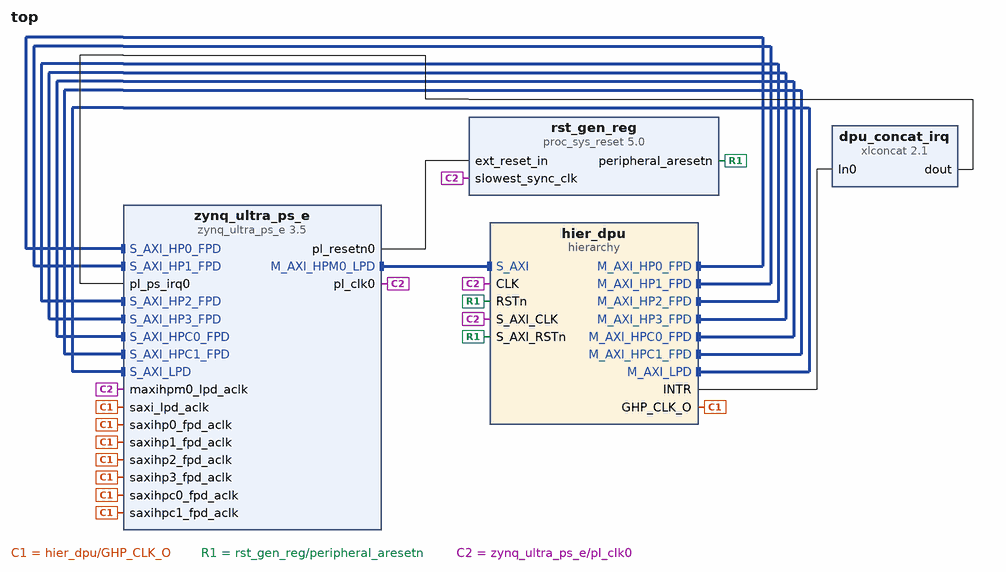
[diagram p0: block diagram of the top level]
# Vivado block design top, xczu9eg-ffvb1156-2-i, Vivado 2024.2
create_bd_design top

create_bd_cell -type hier hier_dpu
create_bd_cell -type ip -vlnv xilinx.com:ip:zynq_ultra_ps_e:3.5 zynq_ultra_ps_e
set_property -dict [list \
  CONFIG.PSU_BANK_0_IO_STANDARD LVCMOS18 \
  CONFIG.PSU_BANK_1_IO_STANDARD LVCMOS18 \
  CONFIG.PSU_BANK_2_IO_STANDARD LVCMOS18 \
  CONFIG.PSU_BANK_3_IO_STANDARD LVCMOS18 \
  CONFIG.PSU_DYNAMIC_DDR_CONFIG_EN 1 \
  CONFIG.PSU_USB3__DUAL_CLOCK_ENABLE 1 \
  CONFIG.PSU__CAN1__PERIPHERAL__ENABLE 1 \
  CONFIG.PSU__CAN1__PERIPHERAL__IO {MIO 24 .. 25} \
  CONFIG.PSU__CRF_APB__ACPU_CTRL__FREQMHZ 1334 \
  CONFIG.PSU__CRF_APB__DDR_CTRL__FREQMHZ 1067 \
  CONFIG.PSU__CRF_APB__DPDMA_REF_CTRL__FREQMHZ 667 \
  CONFIG.PSU__CRF_APB__DPDMA_REF_CTRL__SRCSEL APLL \
  CONFIG.PSU__CRF_APB__DP_AUDIO_REF_CTRL__SRCSEL RPLL \
  CONFIG.PSU__CRF_APB__DP_STC_REF_CTRL__SRCSEL RPLL \
  CONFIG.PSU__CRF_APB__DP_VIDEO_REF_CTRL__SRCSEL VPLL \
  CONFIG.PSU__CRF_APB__GDMA_REF_CTRL__FREQMHZ 667 \
  CONFIG.PSU__CRF_APB__GDMA_REF_CTRL__SRCSEL APLL \
  CONFIG.PSU__CRF_APB__GPU_REF_CTRL__FREQMHZ 500 \
  CONFIG.PSU__CRF_APB__GPU_REF_CTRL__SRCSEL IOPLL \
  CONFIG.PSU__CRF_APB__TOPSW_MAIN_CTRL__SRCSEL DPLL \
  CONFIG.PSU__CRL_APB__ADMA_REF_CTRL__FREQMHZ 500 \
  CONFIG.PSU__CRL_APB__ADMA_REF_CTRL__SRCSEL IOPLL \
  CONFIG.PSU__CRL_APB__CPU_R5_CTRL__FREQMHZ 500 \
  CONFIG.PSU__CRL_APB__CPU_R5_CTRL__SRCSEL IOPLL \
  CONFIG.PSU__CRL_APB__IOU_SWITCH_CTRL__FREQMHZ 250 \
  CONFIG.PSU__CRL_APB__IOU_SWITCH_CTRL__SRCSEL IOPLL \
  CONFIG.PSU__CRL_APB__LPD_SWITCH_CTRL__FREQMHZ 500 \
  CONFIG.PSU__CRL_APB__LPD_SWITCH_CTRL__SRCSEL IOPLL \
  CONFIG.PSU__CRL_APB__PL0_REF_CTRL__FREQMHZ 100 \
  CONFIG.PSU__CRL_APB__PL0_REF_CTRL__SRCSEL IOPLL \
  CONFIG.PSU__CRL_APB__PL1_REF_CTRL__FREQMHZ 334 \
  CONFIG.PSU__CRL_APB__QSPI_REF_CTRL__FREQMHZ 125 \
  CONFIG.PSU__CRL_APB__SDIO1_REF_CTRL__SRCSEL IOPLL \
  CONFIG.PSU__CRL_APB__TIMESTAMP_REF_CTRL__SRCSEL IOPLL \
  CONFIG.PSU__CRL_APB__USB3__ENABLE 1 \
  CONFIG.PSU__CSUPMU__PERIPHERAL__VALID 1 \
  CONFIG.PSU__DDRC__BUS_WIDTH {64 Bit} \
  CONFIG.PSU__DDRC__COMPONENTS UDIMM \
  CONFIG.PSU__DDRC__DEVICE_CAPACITY {4096 MBits} \
  CONFIG.PSU__DDRC__DRAM_WIDTH {8 Bits} \
  CONFIG.PSU__DDRC__ECC Disabled \
  CONFIG.PSU__DDRC__MEMORY_TYPE {DDR 4} \
  CONFIG.PSU__DDRC__SPEED_BIN DDR4_2133P \
  CONFIG.PSU__DDR_HIGH_ADDRESS_GUI_ENABLE 1 \
  CONFIG.PSU__DDR__INTERFACE__FREQMHZ 533.500 \
  CONFIG.PSU__DISPLAYPORT__LANE0__ENABLE 1 \
  CONFIG.PSU__DISPLAYPORT__LANE0__IO {GT Lane1} \
  CONFIG.PSU__DISPLAYPORT__LANE1__ENABLE 1 \
  CONFIG.PSU__DISPLAYPORT__LANE1__IO {GT Lane0} \
  CONFIG.PSU__DISPLAYPORT__PERIPHERAL__ENABLE 1 \
  CONFIG.PSU__DLL__ISUSED 1 \
  CONFIG.PSU__DPAUX__PERIPHERAL__ENABLE 1 \
  CONFIG.PSU__DPAUX__PERIPHERAL__IO {MIO 27 .. 30} \
  CONFIG.PSU__DP__LANE_SEL {Dual Lower} \
  CONFIG.PSU__DP__REF_CLK_FREQ 27 \
  CONFIG.PSU__DP__REF_CLK_SEL {Ref Clk3} \
  CONFIG.PSU__ENET3__FIFO__ENABLE 0 \
  CONFIG.PSU__ENET3__GRP_MDIO__ENABLE 1 \
  CONFIG.PSU__ENET3__GRP_MDIO__IO {MIO 76 .. 77} \
  CONFIG.PSU__ENET3__PERIPHERAL__ENABLE 1 \
  CONFIG.PSU__ENET3__PERIPHERAL__IO {MIO 64 .. 75} \
  CONFIG.PSU__ENET3__PTP__ENABLE 0 \
  CONFIG.PSU__ENET3__TSU__ENABLE 0 \
  CONFIG.PSU__FPGA_PL0_ENABLE 1 \
  CONFIG.PSU__FPGA_PL1_ENABLE 1 \
  CONFIG.PSU__GEM3_COHERENCY 0 \
  CONFIG.PSU__GEM3_ROUTE_THROUGH_FPD 0 \
  CONFIG.PSU__GEM__TSU__ENABLE 0 \
  CONFIG.PSU__GPIO0_MIO__IO {MIO 0 .. 25} \
  CONFIG.PSU__GPIO0_MIO__PERIPHERAL__ENABLE 1 \
  CONFIG.PSU__GPIO1_MIO__IO {MIO 26 .. 51} \
  CONFIG.PSU__GPIO1_MIO__PERIPHERAL__ENABLE 1 \
  CONFIG.PSU__GT__LINK_SPEED HBR \
  CONFIG.PSU__GT__PRE_EMPH_LVL_4 0 \
  CONFIG.PSU__GT__VLT_SWNG_LVL_4 0 \
  CONFIG.PSU__I2C0__PERIPHERAL__ENABLE 1 \
  CONFIG.PSU__I2C0__PERIPHERAL__IO {MIO 14 .. 15} \
  CONFIG.PSU__I2C1__PERIPHERAL__ENABLE 1 \
  CONFIG.PSU__I2C1__PERIPHERAL__IO {MIO 16 .. 17} \
  CONFIG.PSU__PCIE__CLASS_CODE_BASE 0x06 \
  CONFIG.PSU__PCIE__CLASS_CODE_SUB 0x04 \
  CONFIG.PSU__PCIE__DEVICE_ID 0xD021 \
  CONFIG.PSU__PMU_COHERENCY 0 \
  CONFIG.PSU__PMU__AIBACK__ENABLE 0 \
  CONFIG.PSU__PMU__EMIO_GPI__ENABLE 0 \
  CONFIG.PSU__PMU__EMIO_GPO__ENABLE 0 \
  CONFIG.PSU__PMU__GPI0__ENABLE 0 \
  CONFIG.PSU__PMU__GPI1__ENABLE 0 \
  CONFIG.PSU__PMU__GPI2__ENABLE 0 \
  CONFIG.PSU__PMU__GPI3__ENABLE 0 \
  CONFIG.PSU__PMU__GPI4__ENABLE 0 \
  CONFIG.PSU__PMU__GPI5__ENABLE 0 \
  CONFIG.PSU__PMU__GPO0__ENABLE 1 \
  CONFIG.PSU__PMU__GPO0__IO {MIO 32} \
  CONFIG.PSU__PMU__GPO1__ENABLE 1 \
  CONFIG.PSU__PMU__GPO1__IO {MIO 33} \
  CONFIG.PSU__PMU__GPO2__ENABLE 1 \
  CONFIG.PSU__PMU__GPO2__IO {MIO 34} \
  CONFIG.PSU__PMU__GPO2__POLARITY high \
  CONFIG.PSU__PMU__GPO3__ENABLE 1 \
  CONFIG.PSU__PMU__GPO3__IO {MIO 35} \
  CONFIG.PSU__PMU__GPO3__POLARITY low \
  CONFIG.PSU__PMU__GPO4__ENABLE 1 \
  CONFIG.PSU__PMU__GPO4__IO {MIO 36} \
  CONFIG.PSU__PMU__GPO4__POLARITY low \
  CONFIG.PSU__PMU__GPO5__ENABLE 1 \
  CONFIG.PSU__PMU__GPO5__IO {MIO 37} \
  CONFIG.PSU__PMU__GPO5__POLARITY low \
  CONFIG.PSU__PMU__PERIPHERAL__ENABLE 1 \
  CONFIG.PSU__PMU__PLERROR__ENABLE 0 \
  CONFIG.PSU__PSS_REF_CLK__FREQMHZ 33.330 \
  CONFIG.PSU__QSPI_COHERENCY 0 \
  CONFIG.PSU__QSPI_ROUTE_THROUGH_FPD 0 \
  CONFIG.PSU__QSPI__GRP_FBCLK__ENABLE 1 \
  CONFIG.PSU__QSPI__GRP_FBCLK__IO {MIO 6} \
  CONFIG.PSU__QSPI__PERIPHERAL__DATA_MODE x4 \
  CONFIG.PSU__QSPI__PERIPHERAL__ENABLE 1 \
  CONFIG.PSU__QSPI__PERIPHERAL__IO {MIO 0 .. 12} \
  CONFIG.PSU__QSPI__PERIPHERAL__MODE {Dual Parallel} \
  CONFIG.PSU__SATA__LANE1__IO {GT Lane3} \
  CONFIG.PSU__SATA__PERIPHERAL__ENABLE 1 \
  CONFIG.PSU__SATA__REF_CLK_FREQ 125 \
  CONFIG.PSU__SATA__REF_CLK_SEL {Ref Clk1} \
  CONFIG.PSU__SAXIGP6__DATA_WIDTH 32 \
  CONFIG.PSU__SD1_COHERENCY 0 \
  CONFIG.PSU__SD1_ROUTE_THROUGH_FPD 0 \
  CONFIG.PSU__SD1__CLK_100_SDR_OTAP_DLY 0x3 \
  CONFIG.PSU__SD1__CLK_200_SDR_OTAP_DLY 0x3 \
  CONFIG.PSU__SD1__CLK_50_DDR_ITAP_DLY 0x3D \
  CONFIG.PSU__SD1__CLK_50_DDR_OTAP_DLY 0x4 \
  CONFIG.PSU__SD1__CLK_50_SDR_ITAP_DLY 0x15 \
  CONFIG.PSU__SD1__CLK_50_SDR_OTAP_DLY 0x5 \
  CONFIG.PSU__SD1__DATA_TRANSFER_MODE 8Bit \
  CONFIG.PSU__SD1__GRP_CD__ENABLE 1 \
  CONFIG.PSU__SD1__GRP_CD__IO {MIO 45} \
  CONFIG.PSU__SD1__GRP_POW__ENABLE 0 \
  CONFIG.PSU__SD1__GRP_WP__ENABLE 1 \
  CONFIG.PSU__SD1__GRP_WP__IO {MIO 44} \
  CONFIG.PSU__SD1__PERIPHERAL__ENABLE 1 \
  CONFIG.PSU__SD1__PERIPHERAL__IO {MIO 39 .. 51} \
  CONFIG.PSU__SD1__SLOT_TYPE {SD 3.0} \
  CONFIG.PSU__SWDT0__CLOCK__ENABLE 0 \
  CONFIG.PSU__SWDT0__PERIPHERAL__ENABLE 1 \
  CONFIG.PSU__SWDT0__RESET__ENABLE 0 \
  CONFIG.PSU__SWDT1__CLOCK__ENABLE 0 \
  CONFIG.PSU__SWDT1__PERIPHERAL__ENABLE 1 \
  CONFIG.PSU__SWDT1__RESET__ENABLE 0 \
  CONFIG.PSU__TSU__BUFG_PORT_PAIR 0 \
  CONFIG.PSU__TTC0__CLOCK__ENABLE 0 \
  CONFIG.PSU__TTC0__PERIPHERAL__ENABLE 1 \
  CONFIG.PSU__TTC0__WAVEOUT__ENABLE 0 \
  CONFIG.PSU__TTC1__CLOCK__ENABLE 0 \
  CONFIG.PSU__TTC1__PERIPHERAL__ENABLE 1 \
  CONFIG.PSU__TTC1__WAVEOUT__ENABLE 0 \
  CONFIG.PSU__TTC2__CLOCK__ENABLE 0 \
  CONFIG.PSU__TTC2__PERIPHERAL__ENABLE 1 \
  CONFIG.PSU__TTC2__WAVEOUT__ENABLE 0 \
  CONFIG.PSU__TTC3__CLOCK__ENABLE 0 \
  CONFIG.PSU__TTC3__PERIPHERAL__ENABLE 1 \
  CONFIG.PSU__TTC3__WAVEOUT__ENABLE 0 \
  CONFIG.PSU__UART0__BAUD_RATE 115200 \
  CONFIG.PSU__UART0__MODEM__ENABLE 0 \
  CONFIG.PSU__UART0__PERIPHERAL__ENABLE 1 \
  CONFIG.PSU__UART0__PERIPHERAL__IO {MIO 18 .. 19} \
  CONFIG.PSU__UART1__BAUD_RATE 115200 \
  CONFIG.PSU__UART1__MODEM__ENABLE 0 \
  CONFIG.PSU__UART1__PERIPHERAL__ENABLE 1 \
  CONFIG.PSU__UART1__PERIPHERAL__IO {MIO 20 .. 21} \
  CONFIG.PSU__USB0_COHERENCY 0 \
  CONFIG.PSU__USB0__PERIPHERAL__ENABLE 1 \
  CONFIG.PSU__USB0__PERIPHERAL__IO {MIO 52 .. 63} \
  CONFIG.PSU__USB0__REF_CLK_FREQ 26 \
  CONFIG.PSU__USB0__REF_CLK_SEL {Ref Clk2} \
  CONFIG.PSU__USB2_0__EMIO__ENABLE 0 \
  CONFIG.PSU__USB3_0__EMIO__ENABLE 0 \
  CONFIG.PSU__USB3_0__PERIPHERAL__ENABLE 1 \
  CONFIG.PSU__USB3_0__PERIPHERAL__IO {GT Lane2} \
  CONFIG.PSU__USB__RESET__MODE {Boot Pin} \
  CONFIG.PSU__USB__RESET__POLARITY {Active Low} \
  CONFIG.PSU__USE__IRQ0 1 \
  CONFIG.PSU__USE__IRQ1 1 \
  CONFIG.PSU__USE__M_AXI_GP2 1 \
  CONFIG.PSU__USE__S_AXI_GP0 1 \
  CONFIG.PSU__USE__S_AXI_GP1 1 \
  CONFIG.PSU__USE__S_AXI_GP2 1 \
  CONFIG.PSU__USE__S_AXI_GP3 1 \
  CONFIG.PSU__USE__S_AXI_GP4 1 \
  CONFIG.PSU__USE__S_AXI_GP5 1 \
  CONFIG.PSU__USE__S_AXI_GP6 1 \
] [get_bd_cells zynq_ultra_ps_e]
# 116 more settings of zynq_ultra_ps_e are not shown: defaults, MIO pin electricals, DDR timing, and values the tool derives
create_bd_cell -type ip -vlnv xilinx.com:ip:xlconcat:2.1 dpu_concat_irq
set_property -dict {CONFIG.NUM_PORTS 1} [get_bd_cells dpu_concat_irq]
create_bd_cell -type ip -vlnv xilinx.com:ip:proc_sys_reset:5.0 rst_gen_reg

# ---- hierarchy /hier_dpu ----
current_bd_instance /hier_dpu
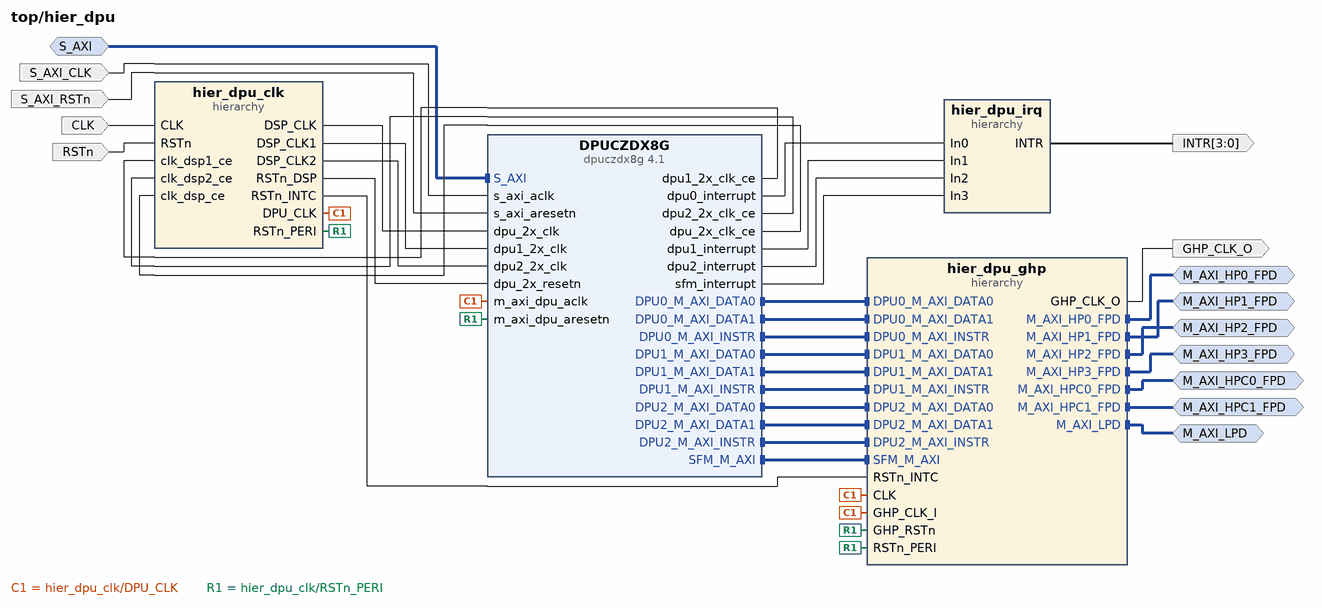
[diagram p1: block diagram inside /hier_dpu]
create_bd_intf_pin -mode Slave -vlnv xilinx.com:interface:aximm_rtl:1.0 S_AXI
create_bd_intf_pin -mode Master -vlnv xilinx.com:interface:aximm_rtl:1.0 M_AXI_HPC0_FPD
create_bd_intf_pin -mode Master -vlnv xilinx.com:interface:aximm_rtl:1.0 M_AXI_HPC1_FPD
create_bd_intf_pin -mode Master -vlnv xilinx.com:interface:aximm_rtl:1.0 M_AXI_HP0_FPD
create_bd_intf_pin -mode Master -vlnv xilinx.com:interface:aximm_rtl:1.0 M_AXI_HP1_FPD
create_bd_intf_pin -mode Master -vlnv xilinx.com:interface:aximm_rtl:1.0 M_AXI_HP2_FPD
create_bd_intf_pin -mode Master -vlnv xilinx.com:interface:aximm_rtl:1.0 M_AXI_HP3_FPD
create_bd_intf_pin -mode Master -vlnv xilinx.com:interface:aximm_rtl:1.0 M_AXI_LPD
create_bd_pin -dir I -type clk S_AXI_CLK
create_bd_pin -dir I -type rst S_AXI_RSTn
create_bd_pin -dir O -type clk GHP_CLK_O
create_bd_pin -dir O -from 3 -to 0 -type intr INTR
create_bd_pin -dir I -type clk CLK
create_bd_pin -dir I -type rst RSTn

create_bd_cell -type hier hier_dpu_clk
create_bd_cell -type hier hier_dpu_ghp
create_bd_cell -type hier hier_dpu_irq
create_bd_cell -type ip -vlnv xilinx.com:ip:dpuczdx8g:4.1 DPUCZDX8G
set_property -dict [list \
  CONFIG.ALU_LEAKYRELU 0 \
  CONFIG.ALU_PARALLEL_USER 4 \
  CONFIG.ARCH 4096 \
  CONFIG.ARCH_IMG_BKGRP 2 \
  CONFIG.CLK_GATING_ENA 1 \
  CONFIG.CONV_DSP_ACCU_ENA 1 \
  CONFIG.CONV_DSP_CASC_MAX 4 \
  CONFIG.CONV_RELU_ADDON 3 \
  CONFIG.CONV_WR_PARALLEL 1 \
  CONFIG.LOAD_AUGM 1 \
  CONFIG.SAVE_ARGMAX_ENA 1 \
  CONFIG.SFM_ENA 1 \
  CONFIG.S_AXI_CLK_INDEPENDENT 1 \
  CONFIG.TIMESTAMP_ENA 1 \
  CONFIG.TIME_DAY 16 \
  CONFIG.TIME_HOUR 8 \
  CONFIG.TIME_MONTH 5 \
  CONFIG.TIME_QUARTER 2 \
  CONFIG.TIME_YEAR 25 \
  CONFIG.URAM_N_USER 0 \
  CONFIG.VER_DPU_NUM 3 \
] [get_bd_cells DPUCZDX8G]

# ---- hierarchy /hier_dpu/hier_dpu_clk ----
current_bd_instance /hier_dpu/hier_dpu_clk
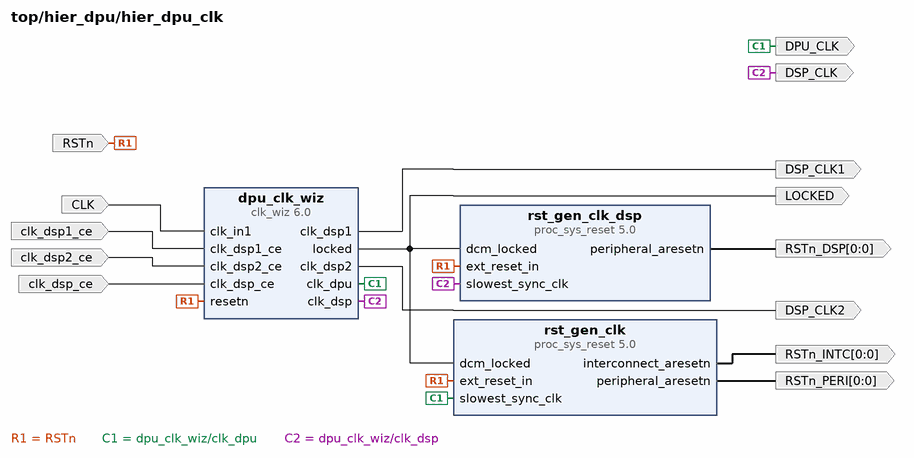
[diagram p2: block diagram inside /hier_dpu/hier_dpu_clk]
create_bd_pin -dir I -type clk CLK
create_bd_pin -dir I -type rst RSTn
create_bd_pin -dir O -type clk DSP_CLK
create_bd_pin -dir O -type clk DSP_CLK1
create_bd_pin -dir O -type clk DSP_CLK2
create_bd_pin -dir O -from 0 -to 0 -type rst RSTn_DSP
create_bd_pin -dir O -type clk DPU_CLK
create_bd_pin -dir O -type data LOCKED
create_bd_pin -dir O -from 0 -to 0 -type rst RSTn_INTC
create_bd_pin -dir O -from 0 -to 0 -type rst RSTn_PERI
create_bd_pin -dir I -type ce clk_dsp_ce
create_bd_pin -dir I -type ce clk_dsp1_ce
create_bd_pin -dir I -type ce clk_dsp2_ce

create_bd_cell -type ip -vlnv xilinx.com:ip:clk_wiz:6.0 dpu_clk_wiz
set_property -dict [list \
  CONFIG.CLKOUT1_DRIVES Buffer_with_CE \
  CONFIG.CLKOUT1_MATCHED_ROUTING true \
  CONFIG.CLKOUT1_REQUESTED_OUT_FREQ 650 \
  CONFIG.CLKOUT2_DRIVES Buffer_with_CE \
  CONFIG.CLKOUT2_MATCHED_ROUTING true \
  CONFIG.CLKOUT2_REQUESTED_OUT_FREQ 650 \
  CONFIG.CLKOUT2_USED true \
  CONFIG.CLKOUT3_DRIVES Buffer_with_CE \
  CONFIG.CLKOUT3_MATCHED_ROUTING true \
  CONFIG.CLKOUT3_REQUESTED_OUT_FREQ 650 \
  CONFIG.CLKOUT3_USED true \
  CONFIG.CLKOUT4_MATCHED_ROUTING true \
  CONFIG.CLKOUT4_REQUESTED_OUT_FREQ 325 \
  CONFIG.CLKOUT4_USED true \
  CONFIG.CLK_OUT1_PORT clk_dsp \
  CONFIG.CLK_OUT2_PORT clk_dsp1 \
  CONFIG.CLK_OUT3_PORT clk_dsp2 \
  CONFIG.CLK_OUT4_PORT clk_dpu \
  CONFIG.PRIMITIVE Auto \
  CONFIG.RESET_TYPE ACTIVE_LOW \
  CONFIG.USE_LOCKED true \
  CONFIG.USE_RESET true \
] [get_bd_cells dpu_clk_wiz]
create_bd_cell -type ip -vlnv xilinx.com:ip:proc_sys_reset:5.0 rst_gen_clk
create_bd_cell -type ip -vlnv xilinx.com:ip:proc_sys_reset:5.0 rst_gen_clk_dsp

# ---- hierarchy /hier_dpu/hier_dpu_ghp ----
current_bd_instance /hier_dpu/hier_dpu_ghp
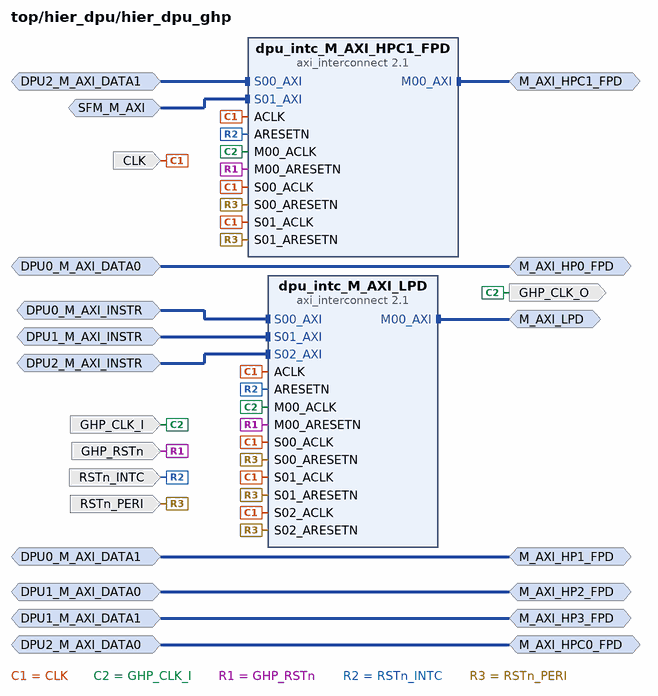
[diagram p3: block diagram inside /hier_dpu/hier_dpu_ghp]
create_bd_intf_pin -mode Slave -vlnv xilinx.com:interface:aximm_rtl:1.0 DPU0_M_AXI_DATA0
create_bd_intf_pin -mode Slave -vlnv xilinx.com:interface:aximm_rtl:1.0 DPU0_M_AXI_DATA1
create_bd_intf_pin -mode Slave -vlnv xilinx.com:interface:aximm_rtl:1.0 DPU0_M_AXI_INSTR
create_bd_intf_pin -mode Slave -vlnv xilinx.com:interface:aximm_rtl:1.0 DPU1_M_AXI_DATA0
create_bd_intf_pin -mode Slave -vlnv xilinx.com:interface:aximm_rtl:1.0 DPU1_M_AXI_DATA1
create_bd_intf_pin -mode Slave -vlnv xilinx.com:interface:aximm_rtl:1.0 DPU1_M_AXI_INSTR
create_bd_intf_pin -mode Slave -vlnv xilinx.com:interface:aximm_rtl:1.0 DPU2_M_AXI_DATA0
create_bd_intf_pin -mode Slave -vlnv xilinx.com:interface:aximm_rtl:1.0 DPU2_M_AXI_DATA1
create_bd_intf_pin -mode Slave -vlnv xilinx.com:interface:aximm_rtl:1.0 DPU2_M_AXI_INSTR
create_bd_intf_pin -mode Slave -vlnv xilinx.com:interface:aximm_rtl:1.0 SFM_M_AXI
create_bd_intf_pin -mode Master -vlnv xilinx.com:interface:aximm_rtl:1.0 M_AXI_HPC0_FPD
create_bd_intf_pin -mode Master -vlnv xilinx.com:interface:aximm_rtl:1.0 M_AXI_HPC1_FPD
create_bd_intf_pin -mode Master -vlnv xilinx.com:interface:aximm_rtl:1.0 M_AXI_HP0_FPD
create_bd_intf_pin -mode Master -vlnv xilinx.com:interface:aximm_rtl:1.0 M_AXI_HP1_FPD
create_bd_intf_pin -mode Master -vlnv xilinx.com:interface:aximm_rtl:1.0 M_AXI_HP2_FPD
create_bd_intf_pin -mode Master -vlnv xilinx.com:interface:aximm_rtl:1.0 M_AXI_HP3_FPD
create_bd_intf_pin -mode Master -vlnv xilinx.com:interface:aximm_rtl:1.0 M_AXI_LPD
create_bd_pin -dir I -type clk CLK
create_bd_pin -dir I -type rst RSTn_INTC
create_bd_pin -dir I -type rst RSTn_PERI
create_bd_pin -dir I -type clk GHP_CLK_I
create_bd_pin -dir I -type rst GHP_RSTn
create_bd_pin -dir O -type clk GHP_CLK_O

create_bd_cell -type ip -vlnv xilinx.com:ip:axi_interconnect:2.1 dpu_intc_M_AXI_LPD
set_property -dict {CONFIG.NUM_MI 1 CONFIG.NUM_SI 3} [get_bd_cells dpu_intc_M_AXI_LPD]
create_bd_cell -type ip -vlnv xilinx.com:ip:axi_interconnect:2.1 dpu_intc_M_AXI_HPC1_FPD
set_property -dict {CONFIG.NUM_MI 1 CONFIG.NUM_SI 2} [get_bd_cells dpu_intc_M_AXI_HPC1_FPD]

# ---- hierarchy /hier_dpu/hier_dpu_irq ----
current_bd_instance /hier_dpu/hier_dpu_irq
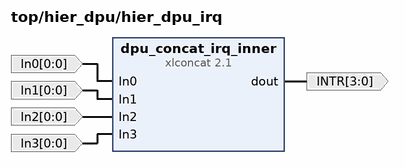
[diagram p4: block diagram inside /hier_dpu/hier_dpu_irq]
create_bd_pin -dir O -from 3 -to 0 -type intr INTR
create_bd_pin -dir I -from 0 -to 0 In0
create_bd_pin -dir I -from 0 -to 0 In1
create_bd_pin -dir I -from 0 -to 0 In2
create_bd_pin -dir I -from 0 -to 0 In3

create_bd_cell -type ip -vlnv xilinx.com:ip:xlconcat:2.1 dpu_concat_irq_inner
set_property -dict {CONFIG.NUM_PORTS 4} [get_bd_cells dpu_concat_irq_inner]

# ---- connections ----

current_bd_instance /hier_dpu
connect_bd_intf_net [get_bd_intf_pins hier_dpu_ghp/M_AXI_HPC0_FPD] [get_bd_intf_pins M_AXI_HPC0_FPD]
connect_bd_intf_net [get_bd_intf_pins hier_dpu_ghp/M_AXI_HPC1_FPD] [get_bd_intf_pins M_AXI_HPC1_FPD]
connect_bd_intf_net [get_bd_intf_pins hier_dpu_ghp/M_AXI_HP0_FPD] [get_bd_intf_pins M_AXI_HP0_FPD]
connect_bd_intf_net [get_bd_intf_pins hier_dpu_ghp/M_AXI_HP1_FPD] [get_bd_intf_pins M_AXI_HP1_FPD]
connect_bd_intf_net [get_bd_intf_pins hier_dpu_ghp/M_AXI_HP2_FPD] [get_bd_intf_pins M_AXI_HP2_FPD]
connect_bd_intf_net [get_bd_intf_pins hier_dpu_ghp/M_AXI_HP3_FPD] [get_bd_intf_pins M_AXI_HP3_FPD]
connect_bd_intf_net [get_bd_intf_pins hier_dpu_ghp/M_AXI_LPD] [get_bd_intf_pins M_AXI_LPD]
connect_bd_intf_net [get_bd_intf_pins DPUCZDX8G/DPU0_M_AXI_DATA0] [get_bd_intf_pins hier_dpu_ghp/DPU0_M_AXI_DATA0]
connect_bd_intf_net [get_bd_intf_pins DPUCZDX8G/DPU0_M_AXI_DATA1] [get_bd_intf_pins hier_dpu_ghp/DPU0_M_AXI_DATA1]
connect_bd_intf_net [get_bd_intf_pins DPUCZDX8G/DPU0_M_AXI_INSTR] [get_bd_intf_pins hier_dpu_ghp/DPU0_M_AXI_INSTR]
connect_bd_intf_net [get_bd_intf_pins DPUCZDX8G/DPU1_M_AXI_DATA0] [get_bd_intf_pins hier_dpu_ghp/DPU1_M_AXI_DATA0]
connect_bd_intf_net [get_bd_intf_pins DPUCZDX8G/DPU1_M_AXI_DATA1] [get_bd_intf_pins hier_dpu_ghp/DPU1_M_AXI_DATA1]
connect_bd_intf_net [get_bd_intf_pins DPUCZDX8G/DPU1_M_AXI_INSTR] [get_bd_intf_pins hier_dpu_ghp/DPU1_M_AXI_INSTR]
connect_bd_intf_net [get_bd_intf_pins DPUCZDX8G/DPU2_M_AXI_DATA0] [get_bd_intf_pins hier_dpu_ghp/DPU2_M_AXI_DATA0]
connect_bd_intf_net [get_bd_intf_pins DPUCZDX8G/DPU2_M_AXI_DATA1] [get_bd_intf_pins hier_dpu_ghp/DPU2_M_AXI_DATA1]
connect_bd_intf_net [get_bd_intf_pins DPUCZDX8G/DPU2_M_AXI_INSTR] [get_bd_intf_pins hier_dpu_ghp/DPU2_M_AXI_INSTR]
connect_bd_intf_net [get_bd_intf_pins DPUCZDX8G/SFM_M_AXI] [get_bd_intf_pins hier_dpu_ghp/SFM_M_AXI]
connect_bd_intf_net [get_bd_intf_pins S_AXI] [get_bd_intf_pins DPUCZDX8G/S_AXI]
connect_bd_net [get_bd_pins CLK] [get_bd_pins hier_dpu_clk/CLK]
connect_bd_net [get_bd_pins DPUCZDX8G/dpu0_interrupt] [get_bd_pins hier_dpu_irq/In0]
connect_bd_net [get_bd_pins DPUCZDX8G/dpu1_2x_clk_ce] [get_bd_pins hier_dpu_clk/clk_dsp1_ce]
connect_bd_net [get_bd_pins DPUCZDX8G/dpu1_interrupt] [get_bd_pins hier_dpu_irq/In1]
connect_bd_net [get_bd_pins DPUCZDX8G/dpu2_2x_clk_ce] [get_bd_pins hier_dpu_clk/clk_dsp2_ce]
connect_bd_net [get_bd_pins DPUCZDX8G/dpu2_interrupt] [get_bd_pins hier_dpu_irq/In2]
connect_bd_net [get_bd_pins DPUCZDX8G/dpu_2x_clk_ce] [get_bd_pins hier_dpu_clk/clk_dsp_ce]
connect_bd_net [get_bd_pins DPUCZDX8G/sfm_interrupt] [get_bd_pins hier_dpu_irq/In3]
connect_bd_net [get_bd_pins RSTn] [get_bd_pins hier_dpu_clk/RSTn]
connect_bd_net [get_bd_pins S_AXI_CLK] [get_bd_pins DPUCZDX8G/s_axi_aclk]
connect_bd_net [get_bd_pins S_AXI_RSTn] [get_bd_pins DPUCZDX8G/s_axi_aresetn]
connect_bd_net [get_bd_pins hier_dpu_clk/DPU_CLK] \
  [get_bd_pins DPUCZDX8G/m_axi_dpu_aclk] [get_bd_pins hier_dpu_ghp/CLK] [get_bd_pins hier_dpu_ghp/GHP_CLK_I]
connect_bd_net [get_bd_pins hier_dpu_clk/DSP_CLK] [get_bd_pins DPUCZDX8G/dpu_2x_clk]
connect_bd_net [get_bd_pins hier_dpu_clk/DSP_CLK1] [get_bd_pins DPUCZDX8G/dpu1_2x_clk]
connect_bd_net [get_bd_pins hier_dpu_clk/DSP_CLK2] [get_bd_pins DPUCZDX8G/dpu2_2x_clk]
connect_bd_net [get_bd_pins hier_dpu_clk/RSTn_DSP] [get_bd_pins DPUCZDX8G/dpu_2x_resetn]
connect_bd_net [get_bd_pins hier_dpu_clk/RSTn_INTC] [get_bd_pins hier_dpu_ghp/RSTn_INTC]
connect_bd_net [get_bd_pins hier_dpu_clk/RSTn_PERI] \
  [get_bd_pins DPUCZDX8G/m_axi_dpu_aresetn] [get_bd_pins hier_dpu_ghp/RSTn_PERI] [get_bd_pins hier_dpu_ghp/GHP_RSTn]
connect_bd_net [get_bd_pins hier_dpu_ghp/GHP_CLK_O] [get_bd_pins GHP_CLK_O]
connect_bd_net [get_bd_pins hier_dpu_irq/INTR] [get_bd_pins INTR]

current_bd_instance /hier_dpu/hier_dpu_clk
connect_bd_net [get_bd_pins CLK] [get_bd_pins dpu_clk_wiz/clk_in1]
connect_bd_net [get_bd_pins RSTn] [get_bd_pins dpu_clk_wiz/resetn] [get_bd_pins rst_gen_clk/ext_reset_in] [get_bd_pins rst_gen_clk_dsp/ext_reset_in]
connect_bd_net [get_bd_pins clk_dsp1_ce] [get_bd_pins dpu_clk_wiz/clk_dsp1_ce]
connect_bd_net [get_bd_pins clk_dsp2_ce] [get_bd_pins dpu_clk_wiz/clk_dsp2_ce]
connect_bd_net [get_bd_pins clk_dsp_ce] [get_bd_pins dpu_clk_wiz/clk_dsp_ce]
connect_bd_net [get_bd_pins dpu_clk_wiz/clk_dpu] [get_bd_pins DPU_CLK] [get_bd_pins rst_gen_clk/slowest_sync_clk]
connect_bd_net [get_bd_pins dpu_clk_wiz/clk_dsp] [get_bd_pins DSP_CLK] [get_bd_pins rst_gen_clk_dsp/slowest_sync_clk]
connect_bd_net [get_bd_pins dpu_clk_wiz/clk_dsp1] [get_bd_pins DSP_CLK1]
connect_bd_net [get_bd_pins dpu_clk_wiz/clk_dsp2] [get_bd_pins DSP_CLK2]
connect_bd_net [get_bd_pins dpu_clk_wiz/locked] [get_bd_pins LOCKED] [get_bd_pins rst_gen_clk/dcm_locked] [get_bd_pins rst_gen_clk_dsp/dcm_locked]
connect_bd_net [get_bd_pins rst_gen_clk_dsp/peripheral_aresetn] [get_bd_pins RSTn_DSP]
connect_bd_net [get_bd_pins rst_gen_clk/interconnect_aresetn] [get_bd_pins RSTn_INTC]
connect_bd_net [get_bd_pins rst_gen_clk/peripheral_aresetn] [get_bd_pins RSTn_PERI]

current_bd_instance /hier_dpu/hier_dpu_ghp
connect_bd_intf_net -intf_net DPU0_M_AXI_DATA0_1 [get_bd_intf_pins DPU0_M_AXI_DATA0] [get_bd_intf_pins M_AXI_HP0_FPD]
connect_bd_intf_net -intf_net DPU0_M_AXI_DATA1_1 [get_bd_intf_pins DPU0_M_AXI_DATA1] [get_bd_intf_pins M_AXI_HP1_FPD]
connect_bd_intf_net [get_bd_intf_pins DPU0_M_AXI_INSTR] [get_bd_intf_pins dpu_intc_M_AXI_LPD/S00_AXI]
connect_bd_intf_net -intf_net DPU1_M_AXI_DATA0_1 [get_bd_intf_pins DPU1_M_AXI_DATA0] [get_bd_intf_pins M_AXI_HP2_FPD]
connect_bd_intf_net -intf_net DPU1_M_AXI_DATA1_1 [get_bd_intf_pins DPU1_M_AXI_DATA1] [get_bd_intf_pins M_AXI_HP3_FPD]
connect_bd_intf_net [get_bd_intf_pins DPU1_M_AXI_INSTR] [get_bd_intf_pins dpu_intc_M_AXI_LPD/S01_AXI]
connect_bd_intf_net -intf_net DPU2_M_AXI_DATA0_1 [get_bd_intf_pins DPU2_M_AXI_DATA0] [get_bd_intf_pins M_AXI_HPC0_FPD]
connect_bd_intf_net -intf_net DPU2_M_AXI_DATA1_1 [get_bd_intf_pins DPU2_M_AXI_DATA1] [get_bd_intf_pins dpu_intc_M_AXI_HPC1_FPD/S00_AXI]
connect_bd_intf_net [get_bd_intf_pins DPU2_M_AXI_INSTR] [get_bd_intf_pins dpu_intc_M_AXI_LPD/S02_AXI]
connect_bd_intf_net [get_bd_intf_pins SFM_M_AXI] [get_bd_intf_pins dpu_intc_M_AXI_HPC1_FPD/S01_AXI]
connect_bd_intf_net [get_bd_intf_pins M_AXI_HPC1_FPD] [get_bd_intf_pins dpu_intc_M_AXI_HPC1_FPD/M00_AXI]
connect_bd_intf_net [get_bd_intf_pins M_AXI_LPD] [get_bd_intf_pins dpu_intc_M_AXI_LPD/M00_AXI]
connect_bd_net [get_bd_pins CLK] \
  [get_bd_pins dpu_intc_M_AXI_LPD/ACLK] [get_bd_pins dpu_intc_M_AXI_LPD/S00_ACLK] [get_bd_pins dpu_intc_M_AXI_LPD/S01_ACLK] \
  [get_bd_pins dpu_intc_M_AXI_LPD/S02_ACLK] [get_bd_pins dpu_intc_M_AXI_HPC1_FPD/ACLK] \
  [get_bd_pins dpu_intc_M_AXI_HPC1_FPD/S00_ACLK] [get_bd_pins dpu_intc_M_AXI_HPC1_FPD/S01_ACLK]
connect_bd_net [get_bd_pins GHP_CLK_I] \
  [get_bd_pins GHP_CLK_O] [get_bd_pins dpu_intc_M_AXI_LPD/M00_ACLK] [get_bd_pins dpu_intc_M_AXI_HPC1_FPD/M00_ACLK]
connect_bd_net [get_bd_pins GHP_RSTn] [get_bd_pins dpu_intc_M_AXI_LPD/M00_ARESETN] [get_bd_pins dpu_intc_M_AXI_HPC1_FPD/M00_ARESETN]
connect_bd_net [get_bd_pins RSTn_INTC] [get_bd_pins dpu_intc_M_AXI_LPD/ARESETN] [get_bd_pins dpu_intc_M_AXI_HPC1_FPD/ARESETN]
connect_bd_net [get_bd_pins RSTn_PERI] \
  [get_bd_pins dpu_intc_M_AXI_LPD/S00_ARESETN] [get_bd_pins dpu_intc_M_AXI_LPD/S01_ARESETN] \
  [get_bd_pins dpu_intc_M_AXI_LPD/S02_ARESETN] [get_bd_pins dpu_intc_M_AXI_HPC1_FPD/S00_ARESETN] \
  [get_bd_pins dpu_intc_M_AXI_HPC1_FPD/S01_ARESETN]

current_bd_instance /hier_dpu/hier_dpu_irq
connect_bd_net -net In0_1 [get_bd_pins In0] [get_bd_pins dpu_concat_irq_inner/In0]
connect_bd_net -net In1_1 [get_bd_pins In1] [get_bd_pins dpu_concat_irq_inner/In1]
connect_bd_net -net In2_1 [get_bd_pins In2] [get_bd_pins dpu_concat_irq_inner/In2]
connect_bd_net -net In3_1 [get_bd_pins In3] [get_bd_pins dpu_concat_irq_inner/In3]
connect_bd_net [get_bd_pins dpu_concat_irq_inner/dout] [get_bd_pins INTR]

current_bd_instance /
connect_bd_intf_net [get_bd_intf_pins zynq_ultra_ps_e/S_AXI_HP0_FPD] [get_bd_intf_pins hier_dpu/M_AXI_HP0_FPD]
connect_bd_intf_net [get_bd_intf_pins zynq_ultra_ps_e/S_AXI_HP1_FPD] [get_bd_intf_pins hier_dpu/M_AXI_HP1_FPD]
connect_bd_intf_net [get_bd_intf_pins zynq_ultra_ps_e/S_AXI_HP2_FPD] [get_bd_intf_pins hier_dpu/M_AXI_HP2_FPD]
connect_bd_intf_net [get_bd_intf_pins zynq_ultra_ps_e/S_AXI_HP3_FPD] [get_bd_intf_pins hier_dpu/M_AXI_HP3_FPD]
connect_bd_intf_net [get_bd_intf_pins zynq_ultra_ps_e/S_AXI_HPC0_FPD] [get_bd_intf_pins hier_dpu/M_AXI_HPC0_FPD]
connect_bd_intf_net [get_bd_intf_pins zynq_ultra_ps_e/S_AXI_HPC1_FPD] [get_bd_intf_pins hier_dpu/M_AXI_HPC1_FPD]
connect_bd_intf_net [get_bd_intf_pins zynq_ultra_ps_e/S_AXI_LPD] [get_bd_intf_pins hier_dpu/M_AXI_LPD]
connect_bd_intf_net [get_bd_intf_pins zynq_ultra_ps_e/M_AXI_HPM0_LPD] [get_bd_intf_pins hier_dpu/S_AXI]
connect_bd_net [get_bd_pins dpu_concat_irq/dout] [get_bd_pins zynq_ultra_ps_e/pl_ps_irq0]
connect_bd_net [get_bd_pins hier_dpu/GHP_CLK_O] \
  [get_bd_pins zynq_ultra_ps_e/saxihpc0_fpd_aclk] [get_bd_pins zynq_ultra_ps_e/saxihpc1_fpd_aclk] \
  [get_bd_pins zynq_ultra_ps_e/saxihp0_fpd_aclk] [get_bd_pins zynq_ultra_ps_e/saxihp1_fpd_aclk] \
  [get_bd_pins zynq_ultra_ps_e/saxihp2_fpd_aclk] [get_bd_pins zynq_ultra_ps_e/saxihp3_fpd_aclk] \
  [get_bd_pins zynq_ultra_ps_e/saxi_lpd_aclk]
connect_bd_net [get_bd_pins hier_dpu/INTR] [get_bd_pins dpu_concat_irq/In0]
connect_bd_net [get_bd_pins rst_gen_reg/peripheral_aresetn] [get_bd_pins hier_dpu/RSTn] [get_bd_pins hier_dpu/S_AXI_RSTn]
connect_bd_net [get_bd_pins zynq_ultra_ps_e/pl_clk0] \
  [get_bd_pins zynq_ultra_ps_e/maxihpm0_lpd_aclk] [get_bd_pins rst_gen_reg/slowest_sync_clk] [get_bd_pins hier_dpu/CLK] \
  [get_bd_pins hier_dpu/S_AXI_CLK]
connect_bd_net [get_bd_pins zynq_ultra_ps_e/pl_resetn0] [get_bd_pins rst_gen_reg/ext_reset_in]

# ---- address map ----
assign_bd_address -offset 0x0000000000 -range 2G -target_address_space [get_bd_addr_spaces hier_dpu/DPUCZDX8G/DPU0_M_AXI_DATA0] [get_bd_addr_segs zynq_ultra_ps_e/SAXIGP2/HP0_DDR_LOW]
assign_bd_address -offset 0x00C0000000 -range 512M -target_address_space [get_bd_addr_spaces hier_dpu/DPUCZDX8G/DPU0_M_AXI_DATA0] [get_bd_addr_segs zynq_ultra_ps_e/SAXIGP2/HP0_QSPI]
assign_bd_address -offset 0x00FF000000 -range 16M -target_address_space [get_bd_addr_spaces hier_dpu/DPUCZDX8G/DPU0_M_AXI_DATA0] [get_bd_addr_segs zynq_ultra_ps_e/SAXIGP2/HP0_LPS_OCM]
assign_bd_address -offset 0x0800000000 -range 32G -target_address_space [get_bd_addr_spaces hier_dpu/DPUCZDX8G/DPU0_M_AXI_DATA0] [get_bd_addr_segs zynq_ultra_ps_e/SAXIGP2/HP0_DDR_HIGH]
assign_bd_address -offset 0x0000000000 -range 2G -target_address_space [get_bd_addr_spaces hier_dpu/DPUCZDX8G/DPU0_M_AXI_DATA1] [get_bd_addr_segs zynq_ultra_ps_e/SAXIGP3/HP1_DDR_LOW]
assign_bd_address -offset 0x00C0000000 -range 512M -target_address_space [get_bd_addr_spaces hier_dpu/DPUCZDX8G/DPU0_M_AXI_DATA1] [get_bd_addr_segs zynq_ultra_ps_e/SAXIGP3/HP1_QSPI]
assign_bd_address -offset 0x00FF000000 -range 16M -target_address_space [get_bd_addr_spaces hier_dpu/DPUCZDX8G/DPU0_M_AXI_DATA1] [get_bd_addr_segs zynq_ultra_ps_e/SAXIGP3/HP1_LPS_OCM]
assign_bd_address -offset 0x0800000000 -range 32G -target_address_space [get_bd_addr_spaces hier_dpu/DPUCZDX8G/DPU0_M_AXI_DATA1] [get_bd_addr_segs zynq_ultra_ps_e/SAXIGP3/HP1_DDR_HIGH]
assign_bd_address -offset 0x0000000000 -range 2G -target_address_space [get_bd_addr_spaces hier_dpu/DPUCZDX8G/DPU0_M_AXI_INSTR] [get_bd_addr_segs zynq_ultra_ps_e/SAXIGP6/LPD_DDR_LOW]
assign_bd_address -offset 0x00C0000000 -range 512M -target_address_space [get_bd_addr_spaces hier_dpu/DPUCZDX8G/DPU0_M_AXI_INSTR] [get_bd_addr_segs zynq_ultra_ps_e/SAXIGP6/LPD_QSPI]
assign_bd_address -offset 0x00FF000000 -range 16M -target_address_space [get_bd_addr_spaces hier_dpu/DPUCZDX8G/DPU0_M_AXI_INSTR] [get_bd_addr_segs zynq_ultra_ps_e/SAXIGP6/LPD_LPS_OCM]
assign_bd_address -offset 0x0800000000 -range 32G -target_address_space [get_bd_addr_spaces hier_dpu/DPUCZDX8G/DPU0_M_AXI_INSTR] [get_bd_addr_segs zynq_ultra_ps_e/SAXIGP6/LPD_DDR_HIGH]
assign_bd_address -offset 0x0000000000 -range 2G -target_address_space [get_bd_addr_spaces hier_dpu/DPUCZDX8G/DPU1_M_AXI_DATA0] [get_bd_addr_segs zynq_ultra_ps_e/SAXIGP4/HP2_DDR_LOW]
assign_bd_address -offset 0x00C0000000 -range 512M -target_address_space [get_bd_addr_spaces hier_dpu/DPUCZDX8G/DPU1_M_AXI_DATA0] [get_bd_addr_segs zynq_ultra_ps_e/SAXIGP4/HP2_QSPI]
assign_bd_address -offset 0x00FF000000 -range 16M -target_address_space [get_bd_addr_spaces hier_dpu/DPUCZDX8G/DPU1_M_AXI_DATA0] [get_bd_addr_segs zynq_ultra_ps_e/SAXIGP4/HP2_LPS_OCM]
assign_bd_address -offset 0x0800000000 -range 32G -target_address_space [get_bd_addr_spaces hier_dpu/DPUCZDX8G/DPU1_M_AXI_DATA0] [get_bd_addr_segs zynq_ultra_ps_e/SAXIGP4/HP2_DDR_HIGH]
assign_bd_address -offset 0x0000000000 -range 2G -target_address_space [get_bd_addr_spaces hier_dpu/DPUCZDX8G/DPU1_M_AXI_DATA1] [get_bd_addr_segs zynq_ultra_ps_e/SAXIGP5/HP3_DDR_LOW]
assign_bd_address -offset 0x00C0000000 -range 512M -target_address_space [get_bd_addr_spaces hier_dpu/DPUCZDX8G/DPU1_M_AXI_DATA1] [get_bd_addr_segs zynq_ultra_ps_e/SAXIGP5/HP3_QSPI]
assign_bd_address -offset 0x00FF000000 -range 16M -target_address_space [get_bd_addr_spaces hier_dpu/DPUCZDX8G/DPU1_M_AXI_DATA1] [get_bd_addr_segs zynq_ultra_ps_e/SAXIGP5/HP3_LPS_OCM]
assign_bd_address -offset 0x0800000000 -range 32G -target_address_space [get_bd_addr_spaces hier_dpu/DPUCZDX8G/DPU1_M_AXI_DATA1] [get_bd_addr_segs zynq_ultra_ps_e/SAXIGP5/HP3_DDR_HIGH]
assign_bd_address -offset 0x0000000000 -range 2G -target_address_space [get_bd_addr_spaces hier_dpu/DPUCZDX8G/DPU1_M_AXI_INSTR] [get_bd_addr_segs zynq_ultra_ps_e/SAXIGP6/LPD_DDR_LOW]
assign_bd_address -offset 0x00C0000000 -range 512M -target_address_space [get_bd_addr_spaces hier_dpu/DPUCZDX8G/DPU1_M_AXI_INSTR] [get_bd_addr_segs zynq_ultra_ps_e/SAXIGP6/LPD_QSPI]
assign_bd_address -offset 0x00FF000000 -range 16M -target_address_space [get_bd_addr_spaces hier_dpu/DPUCZDX8G/DPU1_M_AXI_INSTR] [get_bd_addr_segs zynq_ultra_ps_e/SAXIGP6/LPD_LPS_OCM]
assign_bd_address -offset 0x0800000000 -range 32G -target_address_space [get_bd_addr_spaces hier_dpu/DPUCZDX8G/DPU1_M_AXI_INSTR] [get_bd_addr_segs zynq_ultra_ps_e/SAXIGP6/LPD_DDR_HIGH]
assign_bd_address -offset 0x0000000000 -range 2G -target_address_space [get_bd_addr_spaces hier_dpu/DPUCZDX8G/DPU2_M_AXI_DATA0] [get_bd_addr_segs zynq_ultra_ps_e/SAXIGP0/HPC0_DDR_LOW]
assign_bd_address -offset 0x00C0000000 -range 512M -target_address_space [get_bd_addr_spaces hier_dpu/DPUCZDX8G/DPU2_M_AXI_DATA0] [get_bd_addr_segs zynq_ultra_ps_e/SAXIGP0/HPC0_QSPI]
assign_bd_address -offset 0x00FF000000 -range 16M -target_address_space [get_bd_addr_spaces hier_dpu/DPUCZDX8G/DPU2_M_AXI_DATA0] [get_bd_addr_segs zynq_ultra_ps_e/SAXIGP0/HPC0_LPS_OCM]
assign_bd_address -offset 0x0800000000 -range 32G -target_address_space [get_bd_addr_spaces hier_dpu/DPUCZDX8G/DPU2_M_AXI_DATA0] [get_bd_addr_segs zynq_ultra_ps_e/SAXIGP0/HPC0_DDR_HIGH]
assign_bd_address -offset 0x0000000000 -range 2G -target_address_space [get_bd_addr_spaces hier_dpu/DPUCZDX8G/DPU2_M_AXI_DATA1] [get_bd_addr_segs zynq_ultra_ps_e/SAXIGP1/HPC1_DDR_LOW]
assign_bd_address -offset 0x00C0000000 -range 512M -target_address_space [get_bd_addr_spaces hier_dpu/DPUCZDX8G/DPU2_M_AXI_DATA1] [get_bd_addr_segs zynq_ultra_ps_e/SAXIGP1/HPC1_QSPI]
assign_bd_address -offset 0x00FF000000 -range 16M -target_address_space [get_bd_addr_spaces hier_dpu/DPUCZDX8G/DPU2_M_AXI_DATA1] [get_bd_addr_segs zynq_ultra_ps_e/SAXIGP1/HPC1_LPS_OCM]
assign_bd_address -offset 0x0800000000 -range 32G -target_address_space [get_bd_addr_spaces hier_dpu/DPUCZDX8G/DPU2_M_AXI_DATA1] [get_bd_addr_segs zynq_ultra_ps_e/SAXIGP1/HPC1_DDR_HIGH]
assign_bd_address -offset 0x0000000000 -range 2G -target_address_space [get_bd_addr_spaces hier_dpu/DPUCZDX8G/DPU2_M_AXI_INSTR] [get_bd_addr_segs zynq_ultra_ps_e/SAXIGP6/LPD_DDR_LOW]
assign_bd_address -offset 0x00C0000000 -range 512M -target_address_space [get_bd_addr_spaces hier_dpu/DPUCZDX8G/DPU2_M_AXI_INSTR] [get_bd_addr_segs zynq_ultra_ps_e/SAXIGP6/LPD_QSPI]
assign_bd_address -offset 0x00FF000000 -range 16M -target_address_space [get_bd_addr_spaces hier_dpu/DPUCZDX8G/DPU2_M_AXI_INSTR] [get_bd_addr_segs zynq_ultra_ps_e/SAXIGP6/LPD_LPS_OCM]
assign_bd_address -offset 0x0800000000 -range 32G -target_address_space [get_bd_addr_spaces hier_dpu/DPUCZDX8G/DPU2_M_AXI_INSTR] [get_bd_addr_segs zynq_ultra_ps_e/SAXIGP6/LPD_DDR_HIGH]
assign_bd_address -offset 0x0000000000 -range 2G -target_address_space [get_bd_addr_spaces hier_dpu/DPUCZDX8G/SFM_M_AXI] [get_bd_addr_segs zynq_ultra_ps_e/SAXIGP1/HPC1_DDR_LOW]
assign_bd_address -offset 0x00C0000000 -range 512M -target_address_space [get_bd_addr_spaces hier_dpu/DPUCZDX8G/SFM_M_AXI] [get_bd_addr_segs zynq_ultra_ps_e/SAXIGP1/HPC1_QSPI]
assign_bd_address -offset 0x00FF000000 -range 16M -target_address_space [get_bd_addr_spaces hier_dpu/DPUCZDX8G/SFM_M_AXI] [get_bd_addr_segs zynq_ultra_ps_e/SAXIGP1/HPC1_LPS_OCM]
assign_bd_address -offset 0x0800000000 -range 32G -target_address_space [get_bd_addr_spaces hier_dpu/DPUCZDX8G/SFM_M_AXI] [get_bd_addr_segs zynq_ultra_ps_e/SAXIGP1/HPC1_DDR_HIGH]
assign_bd_address -offset 0x008F000000 -range 16M -target_address_space [get_bd_addr_spaces zynq_ultra_ps_e/Data] [get_bd_addr_segs hier_dpu/DPUCZDX8G/S_AXI/reg0]

validate_bd_design
save_bd_design
